# EasyEDA Pro project EXO-IMU3.eprj, board PCB3
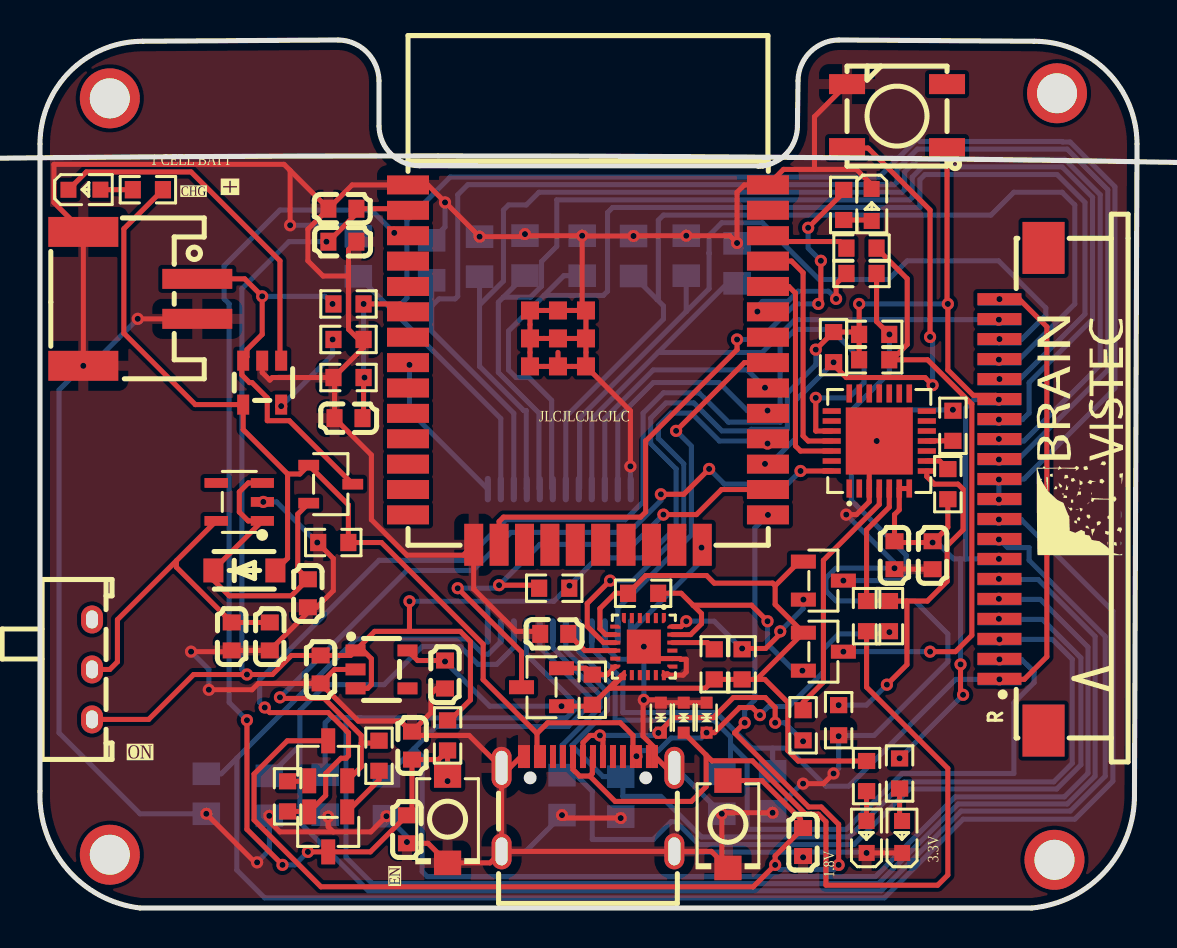
[diagram p2: board, top side]
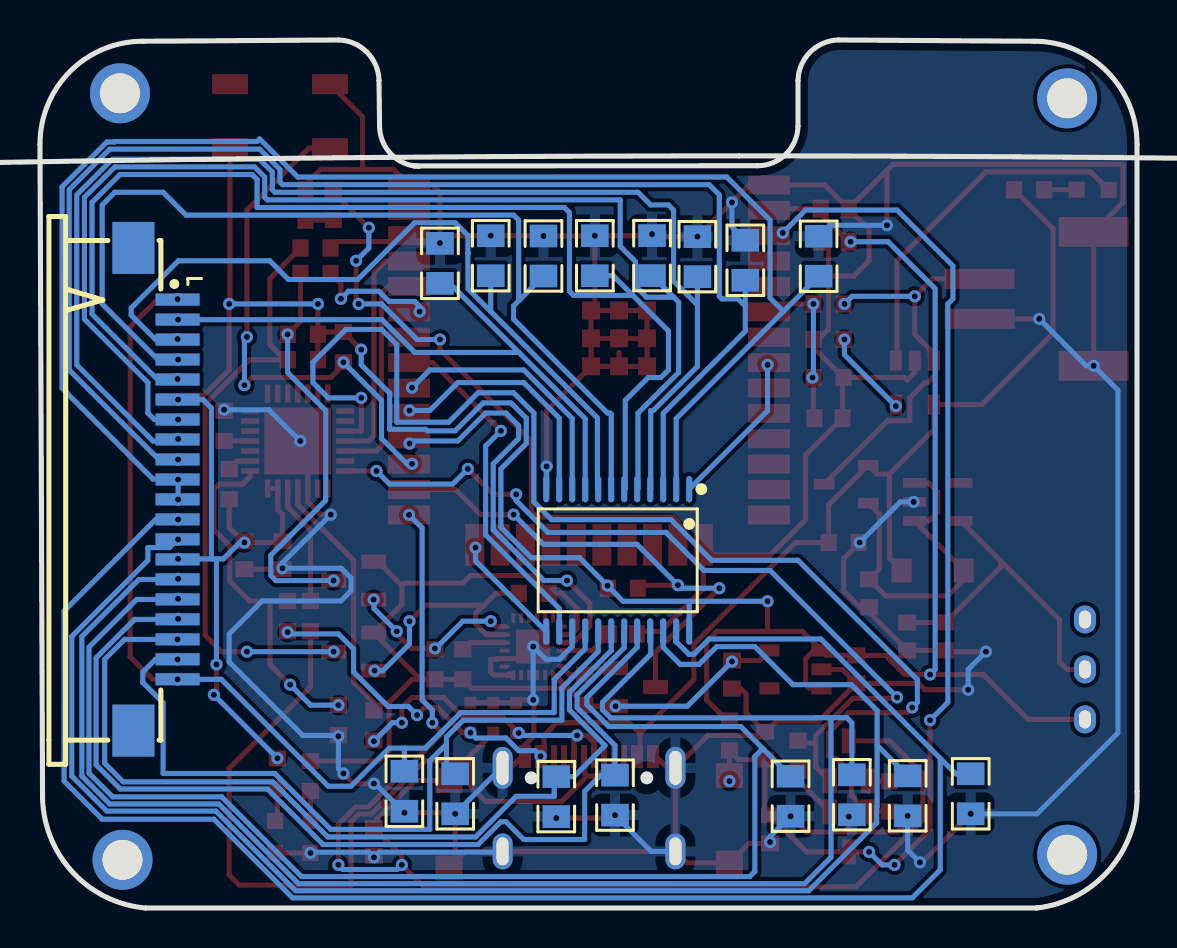
[diagram p3: board, bottom side, seen from below]

Outline 54.86 x 43.43 mm; copper layers: Top Layer, Bottom Layer. Coordinates in mm from the lower left corner of the outline.
Outline path: 36.16,37.13 18.99,37.14 arc(17.57,37.71) 16.95,39.12 16.95,41.4 arc(16.35,42.83) 14.92,43.43 5.14,43.37 arc(1.51,41.86) 0,38.23 0,5.84 arc(1.36,1.94) 5.02,0 49.59,0 arc(53.28,1.85) 54.74,5.72 54.86,38.23 arc(53.36,41.86) 49.72,43.37 39.94,43.43 arc(38.52,42.83) 37.91,41.4 37.88,39.14 arc(37.39,37.82) 36.16,37.13 ; 36.16,37.13 arc(36.03,37.12) 35.9,37.11 ; 19.9,37.64 19.91,37.64 arc(19.91,37.64) 19.9,37.64
Stack: Top Layer 0.035mm / Dielectric1 1.51mm FR4 er 4.5 / Bottom Layer 0.035mm

## Design rules (mm)
template: JLCPCB Capability(Two Layers Board)
spacing copperThickness1oz (default): track to track 0.102, other pairs 0.152 to 0.3
spacing copperThickness2oz: track to track 0.203, other pairs 0.152 to 0.3
track width copperThickness1oz (default): min 0.127, default 0.254, max 2.54
track width copperThickness2oz: min 0.203, default 0.254, max 2.54
differential pair differentialPair (default): width min 0.127, default 0.254, max 2.54; gap min 0.152, default 0.152
via viaSize (default): diameter min 0.5, default 0.61, max 10; hole min 0.3, default 0.305, max 6.3

## Placement (name value [footprint] x y rotation side)
C1  1uF  [C0603]  18.61 8.13 270 top
C4  100nF  [C0603]  44.64 17.65 90 top
C5  4.7uF  [C0603]  42.73 17.65 90 top
C8  100nF  [C0603]  18.35 3.94 90 top
C9  NC  [C0603]  38.16 3.3 90 top
C18  10uF  [C0603]  13.4 15.75 90 top
C19  10uF  [C0603]  11.49 13.59 90 top
C20  100nF  [C0603]  9.59 13.59 90 top
C21  100nF  [C0603]  15.43 24.51 180 top
C23  1uF  [C0603]  20.26 11.68 90 top
C24  1uF  [C0603]  14.03 11.94 90 top
C25  100nF  [C0603]  25.72 13.72 0 top
C26  100nF  [C0603]  15.12 33.34 180 top
C27  10uF  [C0603]  15.12 34.99 0 top
D1  LESD5D5.0CT1G  [SOD-523_L1.2-W0.8-LS1.6-BI]  33.34 9.53 270 top
D2  LESD5D5.0CT1G  [SOD-523_L1.2-W0.8-LS1.6-BI]  31.05 9.53 270 top
D3  LESD5D5.0CT1G  [SOD-523_L1.2-W0.8-LS1.6-BI]  32.19 9.53 270 top
D4  1N5819W  [SOD-123F_L2.8-W1.8-LS3.7-RD]  10.22 16.89 0 top
H1  WAFER-PH2.0-2PWB  [CONN-SMD_2P-P2.00_XUNPU_WAFER-PH2.0-2PWB]  5.02 30.48 270 top
L  AFA07-S20FCC-00  [FPC-SMD_AFA07-S20FCC-00]  49.08 20.96 270 bottom
LDO1  ME6211C33M5G-N  [SOT-23-5_L3.0-W1.7-P0.95-LS2.8-BL]  9.97 20.32 90 top
LED1  XL-1608SURC-06  [LED0603-RD_RED]  2.22 35.94 0 top
LED2  WS2812B-XF02/W  [LED-SMD_4P-L5.0-W5.0-TL]  42.86 39.62 180 top
LED3  XL-1608SURC-06  [LED0603-RD_RED]  43.12 3.56 90 top
LED4  XL-1608SURC-06  [LED0603-RD_RED]  41.34 3.56 90 top
LED5  XL-1608SURC-06  [LED0603-RD_RED]  41.59 35.18 270 top
NOREF  -  [Pad_e295]  3.49 2.67 0 top
NOREF#2  -  [Pad_e282]  50.74 2.41 0 top
NOREF#3  -  [Pad_e291]  3.49 40.51 0 top
NOREF#4  -  [Pad_e290]  50.86 40.77 0 top
Q1  CJ2301 S1  [SOT-23-3_L3.0-W1.7-P0.95-LS2.9-BR]  14.54 21.21 180 top
Q2  SS8050-G  [SOT-23-3_L2.9-W1.3-P1.90-LS2.4-BR]  14.41 7.37 270 top
Q3  SS8050-G  [SOT-23-3_L2.9-W1.3-P1.90-LS2.4-BR]  14.41 3.81 90 top
R  AFA07-S20FCC-00  [FPC-SMD_AFA07-S20FCC-00]  49.08 20.96 90 top
R1  10kΩ  [R0603]  20.38 8.64 90 top
R2  10kΩ  [R0603]  16.95 7.62 90 top
R3  10kΩ  [R0603]  12.38 5.59 270 top
R4  24kΩ  [R0603]  42.48 14.61 90 top
R5  47kΩ  [R0603]  39.94 9.4 270 top
R6  2kΩ  [R0603]  45.4 21.21 270 top
R7  10kΩ  [R0603]  45.66 24.13 90 top
R8  470kΩ  [R0805]  15.92 32.61 90 bottom
R9  470kΩ  [R0805]  8.32 5.72 270 bottom
R10  470kΩ  [R0805]  11.47 5.61 270 bottom
R11  470kΩ  [R0805]  14.26 5.67 270 bottom
R12  470kΩ  [R0805]  17.33 5.59 270 bottom
R13  470kΩ  [R0805]  26.11 5.65 270 bottom
R14  470kΩ  [R0805]  29.04 5.57 270 bottom
R15  470kΩ  [R0805]  34.1 5.72 270 bottom
R16  470kΩ  [R0805]  36.64 5.84 270 bottom
R21  0Ω  [R0603]  41.34 14.61 90 top
R22  0Ω  [R0603]  38.16 9.14 90 top
R25  100kΩ  [R0603]  14.67 18.29 0 top
R26  1kΩ  [R0603]  5.4 35.94 0 top
R27  2kΩ  [R0603]  15.43 28.45 180 top
R28  100kΩ  [R0603]  15.43 26.54 180 top
R29  100kΩ  [R0603]  15.43 30.23 0 top
R30  1kΩ  [R0603]  39.69 28.07 270 top
R35  1kΩ  [R0603]  42.99 6.73 270 top
R36  1kΩ  [R0603]  41.34 6.6 270 top
R37  10kΩ  [R0603]  41.72 28.7 0 top
R38  10kΩ  [R0603]  35.11 12.19 90 top
R39  10kΩ  [R0603]  41.72 27.43 0 top
R40  10kΩ  [R0603]  30.16 15.75 0 top
R41  10kΩ  [R0603]  25.72 16 180 top
R42  10kΩ  [R0603]  27.62 10.92 90 top
R43  10kΩ  [R0603]  33.72 12.19 270 top
R44  1kΩ  [R0603]  40.2 35.18 270 top
R45  0Ω  [R0603]  41.08 33.02 180 top
R46  0Ω  [R0603]  41.08 31.75 180 top
R47  470kΩ  [R0805]  34.86 32.26 90 bottom
R48  470kΩ  [R0805]  32.32 32.64 90 bottom
R49  470kΩ  [R0805]  29.68 32.63 90 bottom
R50  470kΩ  [R0805]  27.11 32.64 90 bottom
R51  470kΩ  [R0805]  24.25 32.65 90 bottom
R52  470kΩ  [R0805]  21.98 32.59 90 bottom
R53  470kΩ  [R0805]  19.59 32.41 90 bottom
SW3  GT-TC029B-H025-L1N  [SW-SMD_L3.9-W3.0-P4.45]  20.38 4.45 270 top
SW4  GT-TC029B-H025-L1N  [SW-SMD_L3.9-W3.0-P4.45]  34.4 4.19 270 top
SW5  SK-3260D-01-L1  [SW-TH_SK-3260D-01-LX]  2.6 11.94 270 top
U2  CP2102N-A02-GQFN28R  [QFN-28_L5.0-W5.0-P0.50-TL-EP3.3]  41.97 23.37 90 top
U7  ESP32-WROOM-32E-N8  [WIFI-SMD_ESP32-WROOM-32E]  27.4 27.18 270 top
U12  TP4054  [SOT-23-5_L2.9-W1.6-P0.95-LS2.8-BR]  11.11 26.29 90 top
U13  ME6211C18M5G-N  [SOT-23-5_L3.0-W1.7-P0.95-LS2.8-BR]  17.08 11.94 180 top
U14  ICM-20948  [QFN-24_L3.0-W3.0-P0.40-BL-EP]  30.2 13.08 180 top
U16  BSS138  [SOT-23-3_L2.9-W1.3-P1.90-LS2.4-BR]  39.18 16.38 180 top
U17  BSS138  [SOT-23-3_L2.9-W1.3-P1.90-LS2.4-BR]  39.18 12.83 180 top
U18  BSS138  [SOT-23-3_L2.9-W1.3-P1.90-LS2.4-BR]  25.08 11.05 0 top
U19  CD74HC4067SM96  [SSOP-24_L8.1-W5.3-P0.65-LS7.8-BL]  25.97 17.4 0 bottom
USB2  TYPEC-304A-ACP16L  [USB-C-SMD_XUNPU_TYPEC-304A-ACP16L]  27.4 5.21 0 top

## Footprints (pads in the part's own frame, mm; a bottom-side part is the same pattern mirrored in y, then rotated)
C0603
  rect 0.8x0.9 smd: 1(-0.7,0) 2(0.7,0)
CONN-SMD_2P-P2.00_XUNPU_WAFER-PH2.0-2PWB
  rect 1x3.5 smd: 1(-1,2.85) 2(1,2.85)
  rect 1.5x3.5 smd: 4(3.35,-2.85) 5(-3.35,-2.85)
FPC-SMD_AFA07-S20FCC-00
  rect 0.6x2.2 smd: 1(-9.486,1.103) 2(-8.486,1.103) 3(-7.484,1.103) 4(-6.486,1.103) 5(-5.486,1.103) 6(-4.486,1.101) 7(-3.486,1.103) 8(-2.486,1.103) 9(-1.487,1.102) 10(-0.487,1.102) 11(0.513,1.102) 12(1.513,1.102) 13(2.513,1.102) 14(3.513,1.102) 15(4.515,1.101) 16(5.514,1.102) 17(6.514,1.102) 18(7.514,1.102) 19(8.514,1.102) 20(9.513,1.102)
  rect 2.6x2.1 smd: 21(-12.075,-1.103) 22(12.075,-1.103)
LED0603-RD_RED
  rect 0.8x0.8 smd: 1(-0.799,-0.004) 2(0.799,0.004)
LED-SMD_4P-L5.0-W5.0-TL
  rect 1.8x1 smd: 1(-2.5,1.6) 2(-2.5,-1.6) 3(2.5,-1.6) 4(2.5,1.6)
Pad_e282
  round 3 hole 2: 1(0,0)
Pad_e290
  round 3 hole 2: 1(0,0)
Pad_e291
  round 3 hole 2: 1(0,0)
Pad_e295
  round 3 hole 2: 1(0,0)
QFN-24_L3.0-W3.0-P0.40-BL-EP
  custom 0.2x0.506 smd: 1(-1,-1.427) 6(1,-1.427) 13(1,1.427) 18(-1,1.427)
  rect 0.2x0.505 smd: 2(-0.6,-1.427) 3(-0.2,-1.427) 4(0.2,-1.427) 5(0.6,-1.427) 14(0.6,1.427) 15(0.2,1.427) 16(-0.2,1.427) 17(-0.6,1.427)
  custom 0.506x0.2 smd: 7(1.427,-1) 12(1.427,1) 19(-1.427,1) 24(-1.427,-1)
  rect 0.505x0.2 smd: 8(1.427,-0.6) 9(1.427,-0.2) 10(1.427,0.2) 11(1.427,0.6) 20(-1.427,0.6) 21(-1.427,0.2) 22(-1.427,-0.2) 23(-1.427,-0.6)
  rect 1.7x1.7 smd: 25(0,0)
QFN-28_L5.0-W5.0-P0.50-TL-EP3.3
  rect 0.905x0.28 smd: 1(-2.377,1.5) 2(-2.377,1) 3(-2.377,0.5) 4(-2.377,0) 5(-2.377,-0.5) 6(-2.377,-1) 7(-2.377,-1.5) 15(2.377,-1.5) 16(2.377,-1) 17(2.377,-0.5) 18(2.377,0) 19(2.377,0.5) 20(2.377,1) 21(2.377,1.5)
  rect 0.28x0.905 smd: 8(-1.5,-2.377) 9(-1,-2.377) 10(-0.5,-2.377) 11(0,-2.377) 12(0.5,-2.377) 13(1,-2.377) 14(1.5,-2.377) 22(1.5,2.377) 23(1,2.377) 24(0.5,2.377) 25(0,2.377) 26(-0.5,2.377) 27(-1,2.377) 28(-1.5,2.377)
  rect 3.35x3.35 smd: 29(0,0)
R0603
  rect 0.806x0.864 smd: 1(-0.753,0) 2(0.753,0)
R0805
  rect 1.133x1.377 smd: 1(-1,0) 2(1,0)
SOD-123F_L2.8-W1.8-LS3.7-RD
  rect 1x1.2 smd: 1(-1.55,0) 2(1.55,0)
SOD-523_L1.2-W0.8-LS1.6-BI
  rect 0.6x0.6 smd: 1(-0.75,0) 2(0.75,0)
SOT-23-3_L2.9-W1.3-P1.90-LS2.4-BR
  rect 1.25x0.7 smd: 1(1,-0.95) 2(1,0.95) 3(-1,0)
SOT-23-3_L3.0-W1.7-P0.95-LS2.9-BR
  rect 1.038x0.532 smd: 1(1.101,-0.95) 2(1.101,0.95) 3(-1.101,0)
SOT-23-5_L2.9-W1.6-P0.95-LS2.8-BR
  rect 1x0.6 smd: 1(1.1,-0.95) 2(1.1,0) 3(1.1,0.95) 4(-1.1,0.95) 5(-1.1,-0.95)
SOT-23-5_L3.0-W1.7-P0.95-LS2.8-BL
  rect 0.49x1.157 smd: 1(-0.95,-1.153) 2(0,-1.153) 3(0.95,-1.153)
  rect 0.49x1.175 smd: 4(0.95,1.153) 5(-0.95,1.153)
SOT-23-5_L3.0-W1.7-P0.95-LS2.8-BR
  rect 1x0.6 smd: 1(1.3,-0.95) 2(1.3,0) 3(1.3,0.95) 4(-1.3,0.95) 5(-1.3,-0.95)
SSOP-24_L8.1-W5.3-P0.65-LS7.8-BL
  oval 0.308x1.324 smd: 1(-3.575,-3.562) 2(-2.925,-3.562) 3(-2.275,-3.562) 4(-1.625,-3.562) 5(-0.975,-3.562) 6(-0.325,-3.562) 7(0.325,-3.562) 8(0.975,-3.562) 9(1.625,-3.562) 10(2.275,-3.562) 11(2.925,-3.562) 12(3.575,-3.562) 13(3.575,3.562) 14(2.925,3.562) 15(2.275,3.562) 16(1.625,3.562) 17(0.975,3.562) 18(0.325,3.562) 19(-0.325,3.562) 20(-0.975,3.562) 21(-1.625,3.562) 22(-2.275,3.562) 23(-2.925,3.562) 24(-3.575,3.562)
SW-SMD_L3.9-W3.0-P4.45
  rect 1.23x1.36 smd: 1(-2.185,0) 2(2.185,0)
SW-TH_SK-3260D-01-LX
  oval 1.4x1.1 hole 0.9x0.6: 1(-2.5,0) 2(0,0) 3(2.5,0)
USB-C-SMD_XUNPU_TYPEC-304A-ACP16L
  oval 1x2.1 hole 0.6x1.7: 25(4.32,1.808) 28(-4.32,1.808)
  oval 1x1.8 hole 0.6x1.4: 26(4.32,-2.373) 27(-4.32,-2.373)
  rect 0.3x1.15 smd: A1(-3.35,2.373) A4(-2.55,2.373) A5(-1.25,2.373) A6(-0.25,2.373) A7(0.25,2.373) A8(1.25,2.373) A9(2.55,2.373) A12(3.35,2.373) B1(3.05,2.373) B4(2.25,2.373) B5(1.75,2.373) B6(0.75,2.373) B7(-0.75,2.373) B8(-1.75,2.373) B9(-2.25,2.373) B12(-3.05,2.373)
WIFI-SMD_ESP32-WROOM-32E
  rect 0.95x2.1 smd: 1(-9.002,-9) 2(-7.732,-9) 3(-6.463,-9) 4(-5.192,-9) 5(-3.922,-9) 6(-2.652,-9) 7(-1.383,-9) 8(-0.113,-9) 9(1.157,-9) 10(2.428,-9) 11(3.697,-9) 12(4.968,-9) 13(6.237,-9) 14(7.508,-9) 25(7.508,9) 26(6.237,9) 27(4.968,9) 28(3.697,9) 29(2.428,9) 30(1.157,9) 31(-0.113,9) 32(-1.383,9) 33(-2.652,9) 34(-3.922,9) 35(-5.192,9) 36(-6.463,9) 37(-7.732,9) 38(-9.002,9)
  rect 2.1x0.95 smd: 15(9.002,-5.715) 16(9.002,-4.445) 17(9.002,-3.175) 18(9.002,-1.905) 19(9.002,-0.635) 20(9.002,0.635) 21(9.002,1.905) 22(9.002,3.175) 23(9.002,4.445) 24(9.002,5.715)
  rect 0.9x0.9 smd: 39(-2.721,-0.1) 39(-2.721,-1.5) 39(-2.721,-2.9) 39(-1.321,-0.1) 39(-1.321,-1.5) 39(-1.321,-2.9) 39(0.079,-0.1) 39(0.079,-1.5) 39(0.079,-2.9)

## Nets
GND: C1.1 C4.1 C5.1 C8.1 C9.1 C18.1 C19.1 C20.1 C21.2 C23.1 C24.1 C25.1 C26.1 C27.1 D1.1 D2.1 D3.1 H1.2 H1.4 H1.5 LDO1.2 LED2.3 LED3.1 LED4.1 LED5.1 R5.2 R7.2 R8.2 R9.2 R10.2 R11.2 R12.2 R13.2 R14.2 R15.2 R16.2 R25.1 R27.1 R28.2 R47.2 R48.2 R49.2 R50.2 R51.2 R52.2 R53.2 SW3.2 SW4.2 U2.3 U2.29 U7.1 U7.15 U7.38 U7.39 U12.2 U13.2 U14.18 U14.20 U14.25 U19.12 U19.15 USB2.25 USB2.26 USB2.27 USB2.28 USB2.A1 USB2.A12 USB2.B1 USB2.B12
VBAT: H1.1 Q1.3 R29.1 U12.3
VBUS: D1.2 D4.2 Q1.1 R4.1 R25.2 R26.2 U12.4 USB2.A4 USB2.A9 USB2.B4 USB2.B9
VDD1.8: C23.2 R36.1 R38.1 R40.1 R42.1 R43.2 U13.5 U14.8 U14.13 U16.1 U17.1 U18.1
VDD33: C4.2 C5.2 C24.2 C26.2 C27.2 L.6 L.14 LED2.1 R.7 R.15 R1.2 R6.2 R30.1 R35.1 R37.1 R39.1 R41.1 SW5.3 U2.6 U2.7 U7.2 U13.1 U13.3 U19.24
VDDOUT: C19.2 C20.2 LDO1.5 SW5.2
DTR: Q2.2 R2.2 U2.28
EN: C1.2 C8.2 Q3.3 R1.1 SW3.1 U7.3
GPIO0: C9.2 Q2.3 SW4.1 U7.25
GPIO34_VBAT: C21.1 R28.1 R29.2 U7.6
I0: L.2 R.19 R47.1 U19.9
I1: L.3 R.18 R48.1 U19.8
I2: L.4 R.17 R49.1 U19.7
I3: L.5 R.16 R50.1 U19.6
I4: L.7 R.14 R51.1 U19.5
I5: L.8 R.13 R52.1 U19.4
I6: L.9 R.12 R53.1 U19.3
I7: L.10 L.11 R.10 R.11 R8.1 U19.2
I8: L.12 R.9 R9.1 U19.23
I9: L.13 R.8 R10.1 U19.22
I10: L.15 R.6 R11.1 U19.21
I11: L.16 R.5 R12.1 U19.20
I12: L.17 R.4 R13.1 U19.19
I13: L.18 R.3 R14.1 U19.18
I14: L.19 R.2 R15.1 U19.17
I15: L.1 L.20 R.1 R.20 R16.1 U19.16
IMU_AD0: U7.28 U14.9
IMU_INT: R41.2 U7.26 U18.3
INT1.8: R42.2 U14.12 U18.2
LED: R44.1 U7.16
RGB_LED: LED2.4 R30.2 U7.27
RTS: Q3.2 R3.2 U2.24
RXD0: U2.25 U7.35
S0: U7.30 U19.10
S1: U7.29 U19.11
S2: U7.31 U19.14
S3: U7.24 U19.13
SCL: R39.2 R45.1 U17.3
SCL1.8: R40.2 U14.23 U17.2
SDA: R37.2 R46.1 U16.3
SDA1.8: R38.2 U14.24 U16.2
SIG: U7.8 U19.1
TXD0: U2.26 U7.34
USB_D+: D2.2 R22.1 USB2.A6 USB2.B6
USB_D-: D3.2 R21.1 USB2.A7 USB2.B7
USB_DN: R21.2 U2.5
USB_DP: R22.2 U2.4
$1N3259: R4.2 R5.1 U2.8
$1N3261: R6.1 U2.9
$1N3262: R7.1 U2.11
$1N3278: C18.2 D4.1 LDO1.1 LDO1.3 Q1.2
$1N3281: R27.2 U12.5
$1N3284: LED1.2 R26.1
$1N3285: LED1.1 U12.1
$1N3293: Q3.1 R2.1
$1N3296: Q2.1 R3.1
$2N1366: LED3.2 R35.2
$2N1372: LED4.2 R36.2
$2N1399: R43.1 U14.22
$2N1403: C25.2 U14.10
$2N1405: LED5.2 R44.2
$2N1424: R45.2 U7.36
$2N1426: R46.2 U7.33

Pads without a net: L 21 22; LDO1 4; LED2 2; NOREF 1; NOREF#2 1; NOREF#3 1; NOREF#4 1; R 21 22; SW5 1; U2 1 2 10 12 13 14 15 16 17 18 19 20 21 22 23 27; U7 4 5 7 9 10 11 12 13 14 17 18 19 20 21 22 23 32 37; U13 4; U14 1 2 3 4 5 6 7 11 14 15 16 17 19 21; USB2 A5 A8 B5 B8

## Via types
v1: diameter 0.61, hole 0.305, Top Layer to Bottom Layer, 130 vias

## Routing (per net, layer and track width the routed paths; a pad name or vN(x,y) marks a point on that pad's centre or on a via; arc(x,y) is an arc through that point)
GND: length 331
  Top Layer w0.254: U7.39 U7.39 ; U7.39 U7.39 ; U7.39 29.53,24.88 v1(29.53,22.1) ; v1(26.11,4.65) 26.25,4.5 v1(29.04,4.5) ; v1(17.33,4.59) 16.54,3.81 14.67,3.81 ; 15.43,31.62 15.43,28.96 15.94,28.45 R27.1 16.18,28.05 R28.2 ; 15.43,31.62 15.43,32.95 C26.1 ; 15.43,31.62 14.16,31.62 13.4,32.39 13.4,33.97 C27.1 ; v1(2.17,27.13) H1.5 0.7,35.3 0.7,37.21 12.21,37.21 12.51,36.91 ; v1(13.87,18.29) 14.67,17.49 14.67,15.88 13.84,15.05 C18.1 13.4,14.79 C19.1 C20.1 9.53,12.83 v1(7.56,12.83) ; C24.1 10.92,11.24 10.6,10.92 v1(8.45,10.92) ; C24.1 15.92,9.36 18.03,9.36 18.55,8.83 C1.1 ; C24.1 14.73,11.94 U13.2 ; 38.73,36.96 40.83,36.96 41.59,36.2 LED5.1 ; 38.73,36.96 37.18,36.96 U7.38 35.23,36.18 34.86,35.81 v1(34.86,33.27) 34.5,33.64 v1(32.32,33.64) 29.7,33.64 v1(29.68,33.63) 27.13,33.63 v1(27.11,33.64) ; 38.73,36.96 38.73,39.6 LED2.3 ; U7.39 U7.39 U7.39 ; U7.39 U7.39 U7.39 U7.39 ; U7.39 U7.39 U7.39 ; C23.1 19.83,10.98 19.55,10.71 19.55,9.78 C1.1 ; C27.1 15.61,36.18 U7.1 19.4,36.18 v1(21.98,33.59) 24.13,33.59 v1(24.25,33.72) 24.34,33.64 v1(27.11,33.64) ; C27.1 12.51,36.91 ; R28.2 14.73,26.49 C21.2 16.57,22.67 16.57,19.43 18.35,17.65 21.17,17.65 U7.15 21.69,15.97 23.81,13.84 24.89,13.84 C25.1 ; R28.2 11.62,26.54 11.49,26.42 11.11,26.8 U12.2 ; 14.67,3.81 14.41,4.06 v1(14.41,4.57) ; 14.67,3.81 12,3.81 11.47,4.34 v1(11.47,4.61) ; 34.1,2.31 33.58,2.83 USB2.26 USB2.27 ; 34.1,2.31 v1(34.1,4.72) 34.15,4.77 v1(36.64,4.77) ; 34.1,2.31 SW4.2 ; USB2.28 USB2.27 ; USB2.28 21.46,8.64 18.8,8.64 C1.1 ; USB2.28 23.49,7.01 USB2.A1 ; USB2.27 22.51,2.26 SW3.2 19.41,3.24 C8.1 ; C4.1 C5.1 ; U7.39 U7.39 ; U7.39 27.11,30.09 v1(27.11,33.64) ; 31.29,11.65 31.34,11.71 31.4,11.71 31.46,11.65 ; 31.29,11.65 31.46,11.65 ; 31.29,11.65 U14.18 ; v1(12.51,34.16) 12.51,36.91 ; 25.9,27.8 U7.39 ; v1(30.2,13.08) 30.8,12.48 U14.20 32.01,12.48 32.04,12.45 32.32,12.45 32.32,11.81 32.16,11.65 31.46,11.65 ; USB2.25 31.32,7.01 30.76,7.58 30.76,8 30.16,8.6 30.16,10.38 v1(30.2,10.41) 30.91,10.41 D2.1 D3.1 D1.1 ; H1.2 v1(4.89,29.48) ; LED3.1 LED4.1 ; v1(39.69,6.73) 39.18,6.22 v1(38.16,6.22) ; U2.29 41.47,22.87 U2.3 41.47,20.33 40.83,19.69 v1(40.32,19.69) ; v1(8.32,4.72) 10.75,2.29 v1(10.86,2.29)
  Bottom Layer w0.254: v1(29.53,22.1) 29.53,20.98 U19.12 ; v1(39.69,6.73) 39.94,6.99 v1(39.94,8.6) ; v1(10.86,2.29) 11.47,2.9 v1(11.47,4.61) ; v1(45.66,24.93) 43.41,24.93 v1(41.85,23.37) ; USB2.25 31.8,7.01 v1(34.1,4.72) ; v1(26.11,4.65) 24.29,2.83 USB2.27 ; v1(41.34,2.76) 41.3,2.79 38.42,2.79 v1(38.16,2.54) 37.91,2.79 31.77,2.79 USB2.26 ; v1(18.35,3.3) 18.35,3.57 v1(17.33,4.59) ; v1(40.32,19.69) 42.73,17.27 v1(42.73,17) 39.8,17 39.31,16.51 39.31,15.88 39.81,15.37 43.75,15.37 45.4,13.72 45.4,12.32 41.72,8.64 39.94,8.64 ; R53.2 20.26,34.08 v1(20.26,35.31) ; v1(30.2,10.41) v1(30.2,13.08) 29.56,12.45 28.89,12.45 28.25,13.09 28.25,13.84 ; v1(4.89,29.48) 2.54,27.13 v1(2.17,27.13) 0.95,25.92 0.95,8.76 5,4.72 v1(8.32,4.72) ; v1(38.16,6.22) 38.09,6.22 v1(36.64,4.77) ; v1(11.17,20.32) 11.84,20.32 v1(13.87,18.29) ; v1(7.56,12.83) 8.45,11.94 v1(8.45,10.92) ; v1(12.51,34.16) 15.37,34.16 R8.2
VBAT: length 20.1
  Top Layer w0.254: H1.1 10.24,31.48 v1(11.11,30.61) 11.11,28.7 10.35,27.94 10.35,27.58 U12.3 10.1,27.32 10.1,26.67 10.48,26.29 10.6,26.29 11.37,25.53 11.37,24.38 12.47,24.38 Q1.3
  Bottom Layer w0.254: v1(11.11,30.61) 14.25,30.61 v1(14.63,30.23)
VBUS: length 69.3
  Top Layer w0.254: 24.86,7.58 24.86,8.74 ; 24.86,8.74 22.16,11.43 22.16,13.2 17.08,18.29 R25.2 15.42,20.18 Q1.1 13,21.72 12.38,21.72 ; 24.86,8.74 25.39,9.27 29.02,9.27 29.65,8.64 USB2.B4 USB2.A9 ; 12.38,21.72 12.38,17.5 D4.2 ; 12.38,21.72 10.16,23.94 10.16,25.19 7.77,25.19 4.2,28.76 4.2,33.99 R26.2 ; v1(33.34,8.78) 33.73,8.78 34.99,10.03 35.62,10.03 v1(36,9.65)
  Bottom Layer w0.254: v1(36,9.65) 36.44,10.08 37.45,10.08 39.18,11.81 39.18,12.95 39.94,13.72 42.39,13.72 v1(42.48,13.81) ; v1(29.83,7.6) 30.11,7.87 30.92,7.87 31.56,8.51 33.07,8.51 v1(33.34,8.78)
VDD1.8: length 49.3
  Top Layer w0.254: U16.1 37.97,17.33 36.77,16.13 ; v1(26.08,10.1) 27.55,10.1 R42.1 29.11,11.65 U14.13 28.54,11 33.28,11 R43.2 R38.1 35.84,11.44 ; 35.84,11.44 36.25,11.44 37.4,10.29 37.4,7.87 37.92,7.36 R36.1 ; 35.84,11.44 U17.1 36.77,15.19 36.77,16.13 ; U14.8 28.29,13.68 28,13.97 28,14.99 28.77,15.75 R40.1 30.3,16.64 33.34,16.64 33.72,16.26 36.64,16.26 36.77,16.13 ; 18.38,12.89 18.89,12.38 C23.2
  Bottom Layer w0.254: v1(20.26,12.33) 22.49,10.1 v1(26.08,10.1)
VDD33: length 150.5
  Top Layer w0.254: R1.2 20.5,9.39 21.53,10.41 21.53,13.34 21.02,13.84 18.4,13.84 ; U13.3 16.39,10.99 16.57,11.18 16.57,12.48 16.16,12.89 U13.1 ; R37.1 v1(40.97,30.23) ; R37.1 40.85,28.82 R30.1 39.68,28.82 v1(38.8,27.94) ; R37.1 R39.1 ; v1(18.48,15.35) 18.48,13.92 18.4,13.84 ; 18.4,13.84 16.74,13.84 U13.1 ; U7.2 18.32,34.99 C27.2 15.83,34.74 C26.2 ; LED2.1 45.36,30.27 v1(45.4,30.23) 45.4,26.92 46.67,25.65 47.8,25.65 R.15 ; U13.1 15.53,12.64 C24.2 12.57,12.64 11.62,11.68 v1(10.35,11.68) 7.68,11.68 5.44,9.44 SW5.3 ; v1(46.16,10.67) 46.04,10.8 v1(46.04,12.19) ; R6.2 45.4,19.05 v1(44.64,18.29) 42.8,18.29 C5.2 42.73,19.69 42.97,19.92 U2.6 U2.7
  Bottom Layer w0.254: 45.99,17.47 45.69,17.47 44.87,18.29 v1(44.64,18.29) ; 45.99,17.47 46.29,17.47 ; 45.99,17.47 46.04,17.43 v1(46.04,12.19) ; 46.29,17.47 46.29,17.47 46.29,25.02 46.71,25.44 v1(47.95,25.44) ; 46.29,17.47 v1(47.96,17.47) L.14 ; v1(42.99,7.49) v1(46.16,10.67) ; 22.4,15.35 v1(18.48,15.35) ; 22.4,15.35 25.7,15.35 v1(26.48,16.13) 27.88,17.53 30.29,17.53 31.81,19.05 31.81,21.97 30.54,23.24 30.54,24.51 31.3,25.27 32.7,25.27 34.1,23.88 35.5,23.88 35.57,23.95 37.38,23.95 37.38,25.76 38.8,27.18 v1(38.8,27.94) ; 22.4,15.35 22.4,13.84 ; v1(45.4,30.23) v1(40.97,30.23) ; v1(10.35,11.68) 10.1,11.94 10.1,30.99 12.45,33.34 v1(14.33,33.34)
VDDOUT: length 16.7
  Top Layer w0.254: 6.82,17.38 6.82,17.05 C20.2 C19.2 ; 6.82,17.38 3.87,14.43 3.87,12.32 3.49,11.94 SW5.2 ; 6.82,17.38 LDO1.5
DTR: length 41.5
  Top Layer w0.254: v1(33.46,21.97) 32.19,20.7 v1(31.05,20.7) ; U2.28 v1(38.04,21.87) ; 16.06,8.26 16.06,7.07 Q2.2 ; 16.06,8.26 16.84,8.26 R2.2 ; 16.06,8.26 16.06,8.64 14.21,10.49 12.05,10.49 v1(12,10.54)
  Bottom Layer w0.254: v1(31.05,20.7) 31.05,20.38 29.46,18.8 23.56,18.8 21.65,16.89 18.35,16.89 v1(12,10.54) ; v1(38.04,21.87) 37.38,21.21 34.23,21.21 v1(33.46,21.97)
EN: length 55
  Top Layer w0.254: v1(13.4,2.81) Q3.3 16.52,2.81 C8.2 18.61,4.89 C1.2 19.93,7.43 R1.1 v1(20.38,6.35) ; v1(12.13,2.16) 10.35,3.94 v1(10.35,9.4)
  Bottom Layer w0.254: v1(17.72,33.78) 16.57,34.93 12,34.93 9.21,32.13 9.21,30.48 9.46,30.23 9.46,10.29 v1(10.35,9.4) ; v1(12.13,2.16) 12.75,2.16 v1(13.4,2.81)
GPIO0: length 66
  Top Layer w0.254: Q2.3 12.37,8.37 10.71,6.71 10.71,4.41 14.05,1.06 35.67,1.06 v1(36.77,2.16) 36.77,2.61 C9.2 38.04,4.13 38.04,4.45 36.11,6.38 SW4.1 ; v1(39.94,2.16) 39.94,4.19 39.07,5.06 38.44,5.06 34.73,8.76 v1(35.24,9.27)
  Bottom Layer w0.254: v1(36.77,2.16) 36.99,1.93 39.71,1.93 v1(39.94,2.16) ; v1(35.24,9.27) 35.24,9.91 35.75,10.41 35.75,19.02 v1(36.4,19.67)
GPIO34_VBAT: length 8.1
  Top Layer w0.254: R28.1 16.18,24.56 C21.1 ; U7.6 18.01,30.23 v1(16.18,30.23)
  Bottom Layer w0.254: v1(16.23,26.54) 16.18,26.59 v1(16.18,30.23)
I0: length 31.3
  Bottom Layer w0.254: U19.9 27.6,24.48 30.91,27.8 ; 30.91,27.8 36.12,27.8 37.76,29.44 L.2 ; 30.91,27.8 34.37,31.26 R47.1
  vias: v1(47.95,29.44)
I1: length 40
  Bottom Layer w0.254: R48.1 32.32,29.86 ; 32.32,29.86 32.33,29.86 33.46,30.99 33.46,32.75 33.45,32.77 33.46,32.77 33.46,33.66 34.1,34.29 36.13,34.29 38.97,31.45 42.44,31.45 43.37,32.39 47.94,32.39 50.3,30.02 50.3,29.67 49.08,28.44 L.3 ; 32.32,29.86 26.99,24.52 26.99,21 U19.8
  vias: v1(47.98,28.47)
I2: length 48.9
  Bottom Layer w0.254: R49.1 30.86,30.45 ; 30.86,30.45 30.92,30.51 30.92,34.42 31.18,34.67 47.56,34.67 48.7,35.81 51.12,35.81 51.75,35.18 51.75,30.23 48.97,27.44 L.4 ; 30.86,30.45 31.18,30.13 31.18,29.46 26.48,24.77 26.35,24.77 26.3,24.71 U19.7
  vias: v1(47.95,27.44)
I3: length 58.7
  Bottom Layer w0.254: L.5 48.98,26.44 52.26,29.72 52.26,35.31 50.86,36.7 44.26,36.7 44.01,36.45 44.01,35.05 28.64,35.05 28.38,34.8 28.38,30.86 28.18,30.65 25.21,30.65 ; 25.21,30.65 23.43,28.87 23.43,26.92 23.81,26.54 24.45,26.54 25.59,25.4 25.59,21.02 U19.6 ; 25.21,30.65 26.2,31.64 R50.1 27.26,31.64
  vias: v1(47.98,26.47)
I4: length 61.3
  Bottom Layer w0.254: 23.17,30.56 24.53,30.56 25.08,31.12 25.08,32.35 25.84,33.11 25.84,35.43 43.5,35.43 43.62,35.56 43.62,36.58 44.13,37.08 51.12,37.08 52.64,35.56 52.64,29.46 49.47,26.29 49.47,24.77 49.14,24.44 L.7 ; 23.17,30.56 R51.1 ; 23.17,30.56 22.92,30.31 22.92,26.8 24.95,24.77 24.95,21 U19.5
  vias: v1(47.95,24.44)
I5: length 64.2
  Bottom Layer w0.254: 21.98,30.18 21.98,27.1 24.19,24.89 24.32,24.89 24.32,20.99 U19.4 ; 21.98,30.18 23.18,31.37 23.18,34.93 23.43,35.18 24.32,35.18 24.95,35.81 43.12,35.81 43.24,35.94 43.24,36.83 43.88,37.47 51.24,37.47 53.02,35.69 53.02,27.18 49.21,23.37 48.06,23.37 L.8 ; 21.98,30.18 R52.1
  vias: v1(47.95,23.47)
I6: length 69.7
  Bottom Layer w0.254: U19.3 23.7,24.75 19.59,28.86 19.59,30.11 ; R53.1 19.59,30.11 ; 19.59,30.11 19.95,30.48 20.76,30.48 20.89,30.61 20.89,35.69 21.4,36.2 42.73,36.2 42.86,36.32 42.86,36.96 43.88,37.97 51.37,37.97 53.4,35.94 53.4,26.92 48.92,22.44 L.9
  vias: v1(47.95,22.44)
I7: length 75.4
  Bottom Layer w0.254: R8.1 17.68,29.85 ; 17.68,29.85 23.05,24.49 U19.2 ; 17.68,29.85 18.35,30.52 18.35,34.41 20.51,36.58 41.97,36.58 43.88,38.48 44.01,38.35 51.12,38.35 51.14,38.33 51.52,38.33 53.76,36.09 53.76,26.01 49.21,21.46 48,21.46 L.10 47.96,21.47 47.83,21.47 ; L.11 47.95,20.47 v1(47.95,21.44)
  vias: v1(47.95,20.44)
I8: length 87.1
  Bottom Layer w0.254: 9.84,7.49 9.06,6.72 R9.1 ; 9.84,7.49 15.81,13.46 21.4,13.46 22.16,12.7 22.42,12.7 23.05,13.33 23.05,13.84 ; 9.84,7.49 9.84,1.91 11.24,0.51 42.23,0.51 46.16,4.45 51.75,4.45 53.66,6.35 53.66,14.86 49.07,19.44 v1(47.95,19.44)
I9: length 80
  Bottom Layer w0.254: 13,8.15 13,9.89 14.29,11.18 17.21,11.18 19.11,13.08 21.02,13.08 21.91,12.19 22.84,12.19 23.7,13.05 23.7,13.84 ; 13,8.15 R10.1 ; 13,8.15 13,5.08 13.02,5.07 13.02,4.26 16.42,0.86 42.08,0.86 46.07,4.85 51.52,4.85 53.27,6.6 53.27,13.59 49.47,17.4 49.47,18.03 48.39,18.03 L.13
  vias: v1(47.95,18.44)
I10: length 80.5
  Bottom Layer w0.254: 24.35,13.84 24.32,13.81 24.32,12.7 26.73,10.29 26.73,9.93 26.32,9.51 16.05,9.51 16.04,9.53 15.3,9.53 ; L.15 49.92,16.44 52.77,13.59 52.77,6.6 51.38,5.21 45.92,5.21 41.93,1.22 16.62,1.22 15.3,2.54 15.3,9.53 ; 15.3,9.53 14.52,9.53 14.26,9.27 R11.1
  vias: v1(47.95,16.47)
I11: length 70
  Bottom Layer w0.254: 25,13.84 25,13.05 27.51,10.53 27.51,10.18 26.42,9.08 19.81,9.08 18.71,7.98 ; 18.71,7.98 19.11,7.58 19.11,1.83 19.37,1.57 41.79,1.57 45.77,5.56 51.23,5.56 52.41,6.75 52.41,13.06 50.03,15.44 L.16 ; 18.71,7.98 R12.1
  vias: v1(47.95,15.47)
I12: length 50.4
  Bottom Layer w0.254: 25.65,13.84 25.65,13.03 28,10.67 28,10.03 26.11,8.14 R13.1 26.82,6.65 27.62,5.84 27.62,3.43 30.67,3.43 31.56,4.32 31.81,4.32 32.96,3.18 40.7,3.18 43.48,5.96 50.85,5.96 52.06,7.17 52.06,12.52 50.13,14.44 L.17
  vias: v1(47.95,14.47)
I13: length 45.5
  Bottom Layer w0.254: 26.3,13.84 26.3,12.88 28.38,10.8 28.38,9.91 26.61,8.13 26.61,8.13 28.16,6.57 R14.1 29.15,6.47 29.15,5.59 31.05,5.59 33.08,3.56 40.47,3.56 43.23,6.31 50.7,6.31 51.62,7.24 51.62,12.45 50.63,13.44 v1(47.98,13.44)
I14: length 39.9
  Bottom Layer w0.254: 26.95,13.84 26.95,12.83 28.77,11.01 28.77,9.4 33.7,9.4 34.53,8.56 34.53,8.2 ; v1(47.98,12.44) 49.09,12.44 49.72,11.81 49.72,11.28 48.7,10.27 48.7,6.73 43.12,6.73 40.32,3.94 35.37,3.94 35.37,7.37 34.53,8.2 ; 34.53,8.2 34.53,7.15 R15.1
I15: length 50.7
  Top Layer w0.254: v1(47.98,11.44) 49.22,11.44 50.36,12.57 50.36,29.08 48.97,30.47 v1(47.98,30.47)
  Bottom Layer w0.254: 27.6,13.84 27.6,12.98 29.15,11.43 29.15,9.78 33.82,9.78 35.6,8 36.64,8 ; 36.64,8 R16.1 ; 36.64,8 37.4,8 39.31,6.1 40.45,6.1 45.8,11.44 v1(47.98,11.44)
IMU_AD0: length 21.1
  Top Layer w0.254: v1(28.51,16.38) 27.37,15.24 27.37,14.1 28.18,13.28 U14.9
  Bottom Layer w0.254: 36.26,23.37 33.97,23.37 32.58,24.77 31.56,24.77 30.92,24.13 30.92,23.5 32.19,22.23 32.19,18.92 29.65,16.38 v1(28.51,16.38)
  vias: v1(36.39,23.24)
IMU_INT: length 25.9
  Top Layer w0.254: R41.2 24.81,16.15 v1(22.96,16.15) ; U7.26 34.08,20.94 32.83,19.69 v1(31.18,19.69) ; U18.3 24.08,12.81 v1(20.89,16)
  Bottom Layer w0.254: v1(20.89,16) 22.81,16 v1(22.96,16.15) 25,18.2 29.69,18.2 v1(31.18,19.69)
INT1.8: length 3
  Top Layer w0.254: U18.2 27.3,12 R42.2 28.37,11.68 U14.12
LED: length 30.8
  Top Layer w0.254: v1(34.86,28.45) 34.86,27.94 30.29,23.37 30.29,19.81 30.04,19.56 23.18,19.56 22.96,19.34 U7.16 ; R44.1 40.2,35.81 v1(38.42,34.04) ; v1(39.05,32.39) 39.05,30.35 v1(38.92,30.23)
  Bottom Layer w0.254: v1(39.05,32.39) 38.42,33.02 v1(38.42,34.04) ; v1(38.92,30.23) 37.78,30.23 36,28.45 v1(34.86,28.45)
RGB_LED: length 26.1
  Top Layer w0.254: v1(44.64,26.16) 44.26,26.54 40.32,26.54 39.69,27.18 v1(39.69,27.31) ; v1(44.51,28.58) 44.51,34.93 41.41,38.02 LED2.4
  Bottom Layer w0.254: v1(44.51,28.58) 44.64,28.45 v1(44.64,26.16) ; v1(39.69,27.31) 37.78,25.4 37.78,23.5 36.51,22.23
  vias: v1(36.26,22.23)
RTS: length 62.7
  Top Layer w0.254: v1(38.8,25.53) 38.8,23.88 38.81,23.87 U2.24 ; v1(11.24,10.03) 11.49,9.78 14.41,9.78 15.43,8.76 15.43,7.62 15.3,7.49 15.05,7.49 14.29,6.73 14.29,5.63 Q3.2 13.44,4.83 R3.2
  Bottom Layer w0.254: v1(11.24,10.03) 10.98,10.29 10.98,11.43 16.95,17.4 21.27,17.4 23.3,19.43 29.27,19.43 30.16,20.32 30.16,24.77 31.18,25.78 32.96,25.78 34.43,24.31 37.02,24.31 37.02,28.19 37.78,28.95 39.56,28.95 41.21,27.31 41.21,26.29 40.45,25.53 v1(38.8,25.53)
RXD0: length 11.7
  Top Layer w0.254: U7.35 37.58,32.37 38.16,31.79 38.16,23.62 38.42,23.37 U2.25
S0: length 12.9
  Bottom Layer w0.254: U19.10 28.25,24.5 30.67,26.92 35.37,26.92 v1(36.26,26.04)
S1: length 12.4
  Bottom Layer w0.254: U19.11 28.9,24.52 30.67,26.29 33.97,26.29 35.37,24.89 v1(36.39,24.89)
S2: length 17.9
  Top Layer w0.254: U7.31 35.23,27.29 v1(31.81,23.88)
  Bottom Layer w0.254: v1(31.81,23.88) 32.58,23.11 32.58,18.67 28.9,14.99 28.9,13.84
S3: length 5.7
  Bottom Layer w0.254: 29.55,13.84 33.08,17.37 v1(33.08,18.03)
SCL: length 29.9
  Top Layer w0.254: v1(44.51,12.83) 45.78,12.83 46.6,13.65 46.6,25.22 44.39,27.43 42.61,27.43 ; 42.61,27.43 43.37,28.19 43.37,31.49 R45.1 ; 42.61,27.43 R39.2
  Bottom Layer w0.254: v1(44.51,12.83) v1(40.18,12.83)
SCL1.8: length 12.3
  Top Layer w0.254: 32.66,15.15 33.08,14.73 33.08,14.22 32.54,13.68 U14.23 ; 32.66,15.15 32.07,15.75 R40.2 ; 32.66,15.15 35.58,15.15 v1(36.39,14.35)
  Bottom Layer w0.254: v1(38.13,11.88) 37.72,11.88 36.39,13.21 v1(36.39,14.35)
SDA: length 20.6
  Top Layer w0.254: v1(42.48,28.7) 41.84,29.35 R46.1
  Bottom Layer w0.254: v1(42.48,28.7) 42.48,26.8 40.58,24.89 40.58,20.4 43.32,17.65 43.32,16.64 43.07,16.38 v1(40.18,16.38)
SDA1.8: length 8.4
  Top Layer w0.254: v1(32.32,14.35) 32.05,14.08 U14.24 ; 37.15,13.84 36.29,12.99 v1(35.11,12.99)
  Bottom Layer w0.254: v1(37.02,13.84) 38.16,14.99 38.16,15.37 ; 35.01,13.06 33.72,14.35 v1(32.32,14.35)
  vias: v1(38.18,15.43)
SIG: length 7.8
  Bottom Layer w0.254: v1(18.48,27.18) 18.48,24.88 U19.1
TXD0: length 11.1
  Top Layer w0.254: U7.34 37.45,31.1 37.78,30.77 37.78,23.12 38.04,22.87 U2.26
USB_D+: length 15.1
  Top Layer w0.254: USB2.B6 28.15,8.43 27.95,8.64 27.51,8.64 27.15,8.28 USB2.A6 ; v1(30.92,8.76) 31.69,9.53 33.67,9.53 34.68,10.53 36.27,10.53 36.77,10.03 v1(36.77,9.27)
  Bottom Layer w0.254: v1(28,8.64) 30.8,8.64 v1(30.92,8.76) ; v1(38.16,8.34) 37.24,9.27 v1(36.77,9.27)
USB_D-: length 43.2
  Top Layer w0.254: 33.31,7.66 33.31,6.07 32.58,5.33 28.77,5.33 27.49,6.6 ; 33.31,7.66 33.6,7.37 35.62,7.37 38.29,4.7 38.92,4.7 39.31,4.32 39.31,1.14 44.89,1.14 45.4,1.65 45.4,6.99 41.34,11.05 R21.1 ; 33.31,7.66 D3.2 ; 27.49,6.6 26.99,6.6 26.65,6.94 USB2.B7 ; 27.49,6.6 27.62,6.73 27.62,7.55 USB2.A7
USB_DN: length 6.1
  Top Layer w0.254: U2.5 42.47,20.06 41.34,18.92 R21.2
USB_DP: length 12.7
  Top Layer w0.254: R22.2 38.16,10.29 39.18,11.3 39.18,17.4 41.97,20.19 U2.4
$1N3259: length 18
  Top Layer w0.254: 43.36,15.36 44.38,15.36 45.37,16.35 45.37,18.13 46.16,18.92 46.16,20.96 45.91,21.21 44.73,21.21 44.35,21.59 U2.8 ; 43.36,15.36 R4.2 ; 43.36,15.36 43.36,12.18 v1(42.35,11.18)
  Bottom Layer w0.254: v1(42.35,11.18) 41.33,10.15 v1(39.94,10.15)
$1N3261: length 1.2
  Top Layer w0.254: U2.9 45,22.37 R6.1
$1N3262: length 1.3
  Top Layer w0.254: U2.11 44.55,23.37 44.56,23.38 R7.1
$1N3278: length 17.3
  Top Layer w0.254: LDO1.3 10.42,21.27 9.97,20.82 9.97,19.81 10.41,19.37 LDO1.1 8.67,16.92 D4.1 8.67,16.41 9.46,15.62 12.57,15.62 C18.2 12.89,16.96 12.89,19.71 13.44,20.26
$1N3281: length 4.4
  Bottom Layer w0.254: v1(12.06,25.11) 14.64,27.69 v1(14.64,28.45)
$1N3284: length 1.6
  Top Layer w0.254: R26.1 4.64,35.94 LED1.2
$1N3285: length 17.8
  Top Layer w0.254: LED1.1 2.31,36.83 7.56,36.83 12,32.39 12,27.45 U12.1
$1N3293: length 2.7
  Top Layer w0.254: Q3.1 16.95,6.4 R2.1
$1N3296: length 1.1
  Top Layer w0.254: R3.1 13.44,6.34 Q2.1
$2N1366: length 1.7
  Top Layer w0.254: R35.2 42.99,4.48 LED3.2
$2N1372: length 1.5
  Top Layer w0.254: R36.2 41.34,4.36 LED4.2
$2N1399: length 2.2
  Top Layer w0.254: U14.22 33.38,13.28 R43.1
$2N1403: length 2.7
  Top Layer w0.254: U14.10 27.25,12.88 C25.2
$2N1405: length 1.4
  Top Layer w0.254: R44.2 41.55,34.43 LED5.2
$2N1424: length 4.2
  Top Layer w0.254: R45.2 40,33.35 36.7,33.35 U7.36
$2N1426: length 6.1
  Top Layer w0.254: v1(39.81,30.48) 39.81,31.23 R46.2
  Bottom Layer w0.254: v1(35.88,29.85) 35.88,30.1 36.13,30.35 37.41,30.35 37.91,30.86 39.43,30.86 v1(39.81,30.48)

## Copper pours and planes (outline as drawn; the poured copper is in the pictures)
GND on Top Layer: -6.92,58.42 67.12,58.42 67.12,-9.27 -6.92,-9.27
GND on Bottom Layer: -11.24,65.02 73.47,65.02 73.47,-11.05 -11.24,-11.05

## Text on the board
Top Silkscreen Layer: CHG | JLCJLCJLCJLC | 1.8V | 3.3V | 1 CELL BATT | EN | ON | +
